# EasyEDA Pro project msq_ethrottle_tssop.eprj

# Schematic Schematic1

## Sheets
1 MCU: Create Date: 2023-01-29; Page Name: MCU; Project Name: msq-dbw; Schematic Name: Schematic1; Update Date: 2023-03-14; Company: EasyEDA.com; Drawed: EasyEDA Pro; Page Size: A4; Part Number: JLCPCB-002; Reviewed: EasyEDA Pro; Version: V0.1
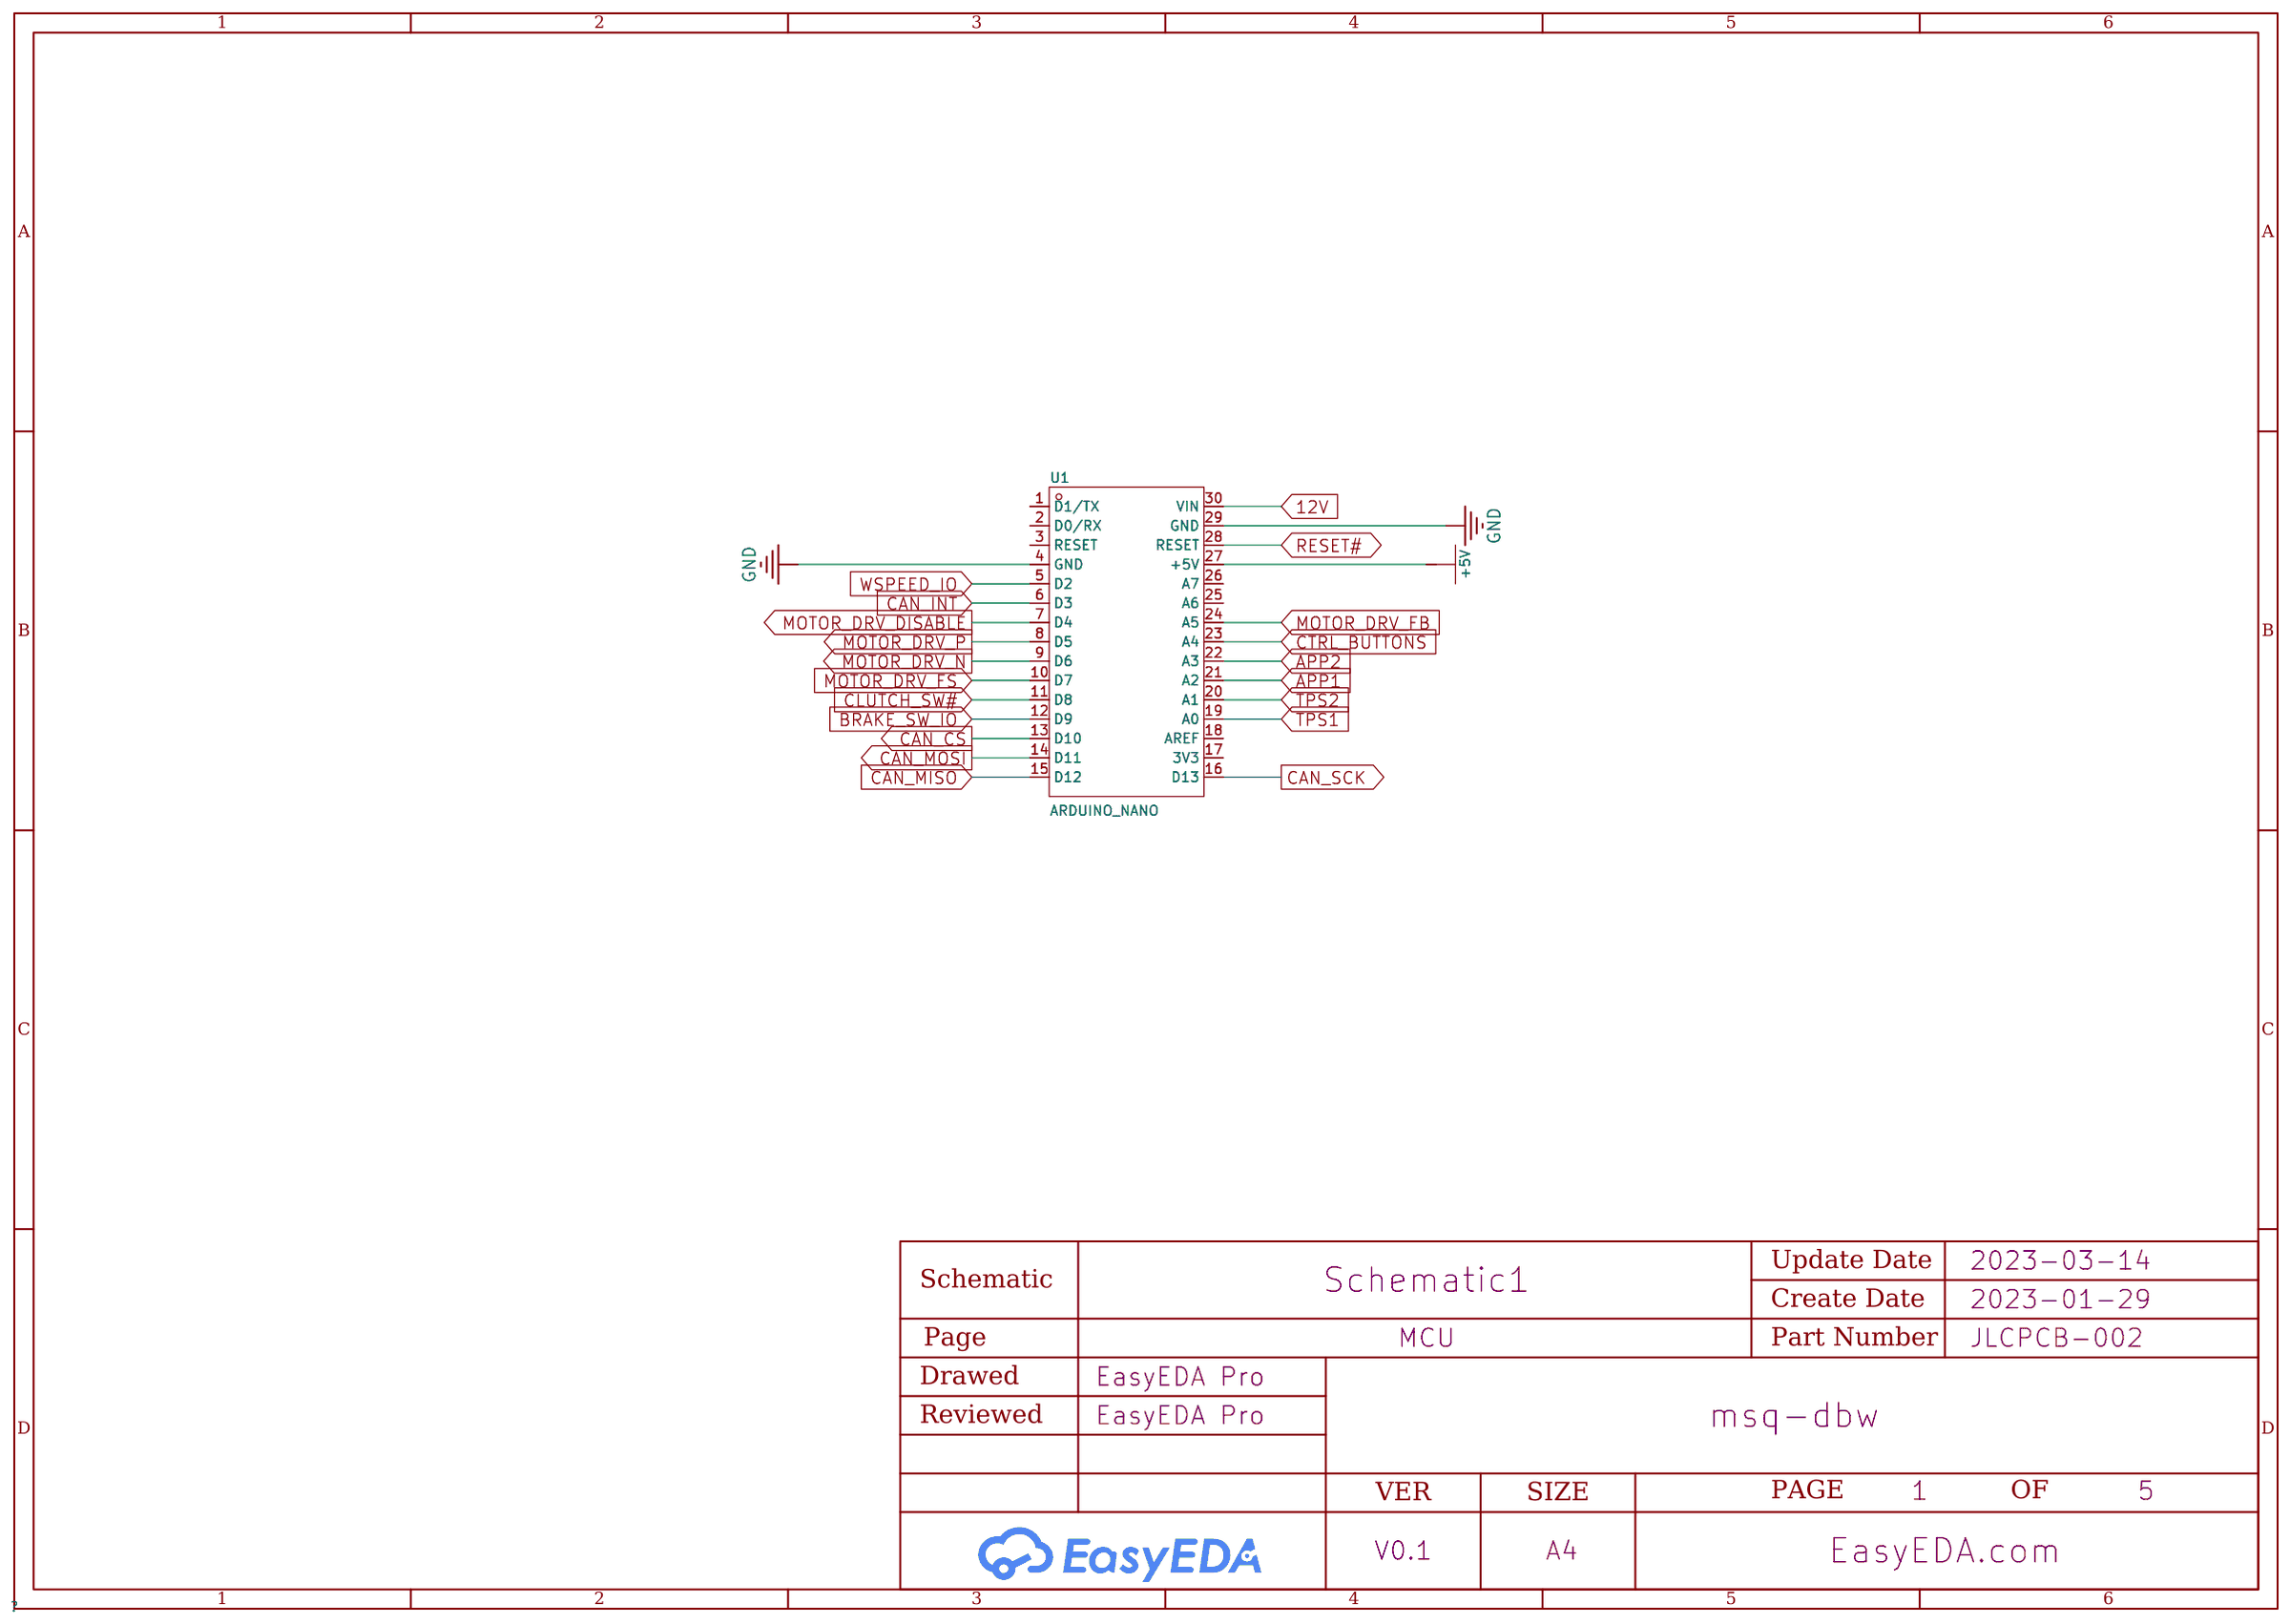
[diagram p0: MCU]
2 I/O: Page Name: I/O; Update Date: 2023-03-11
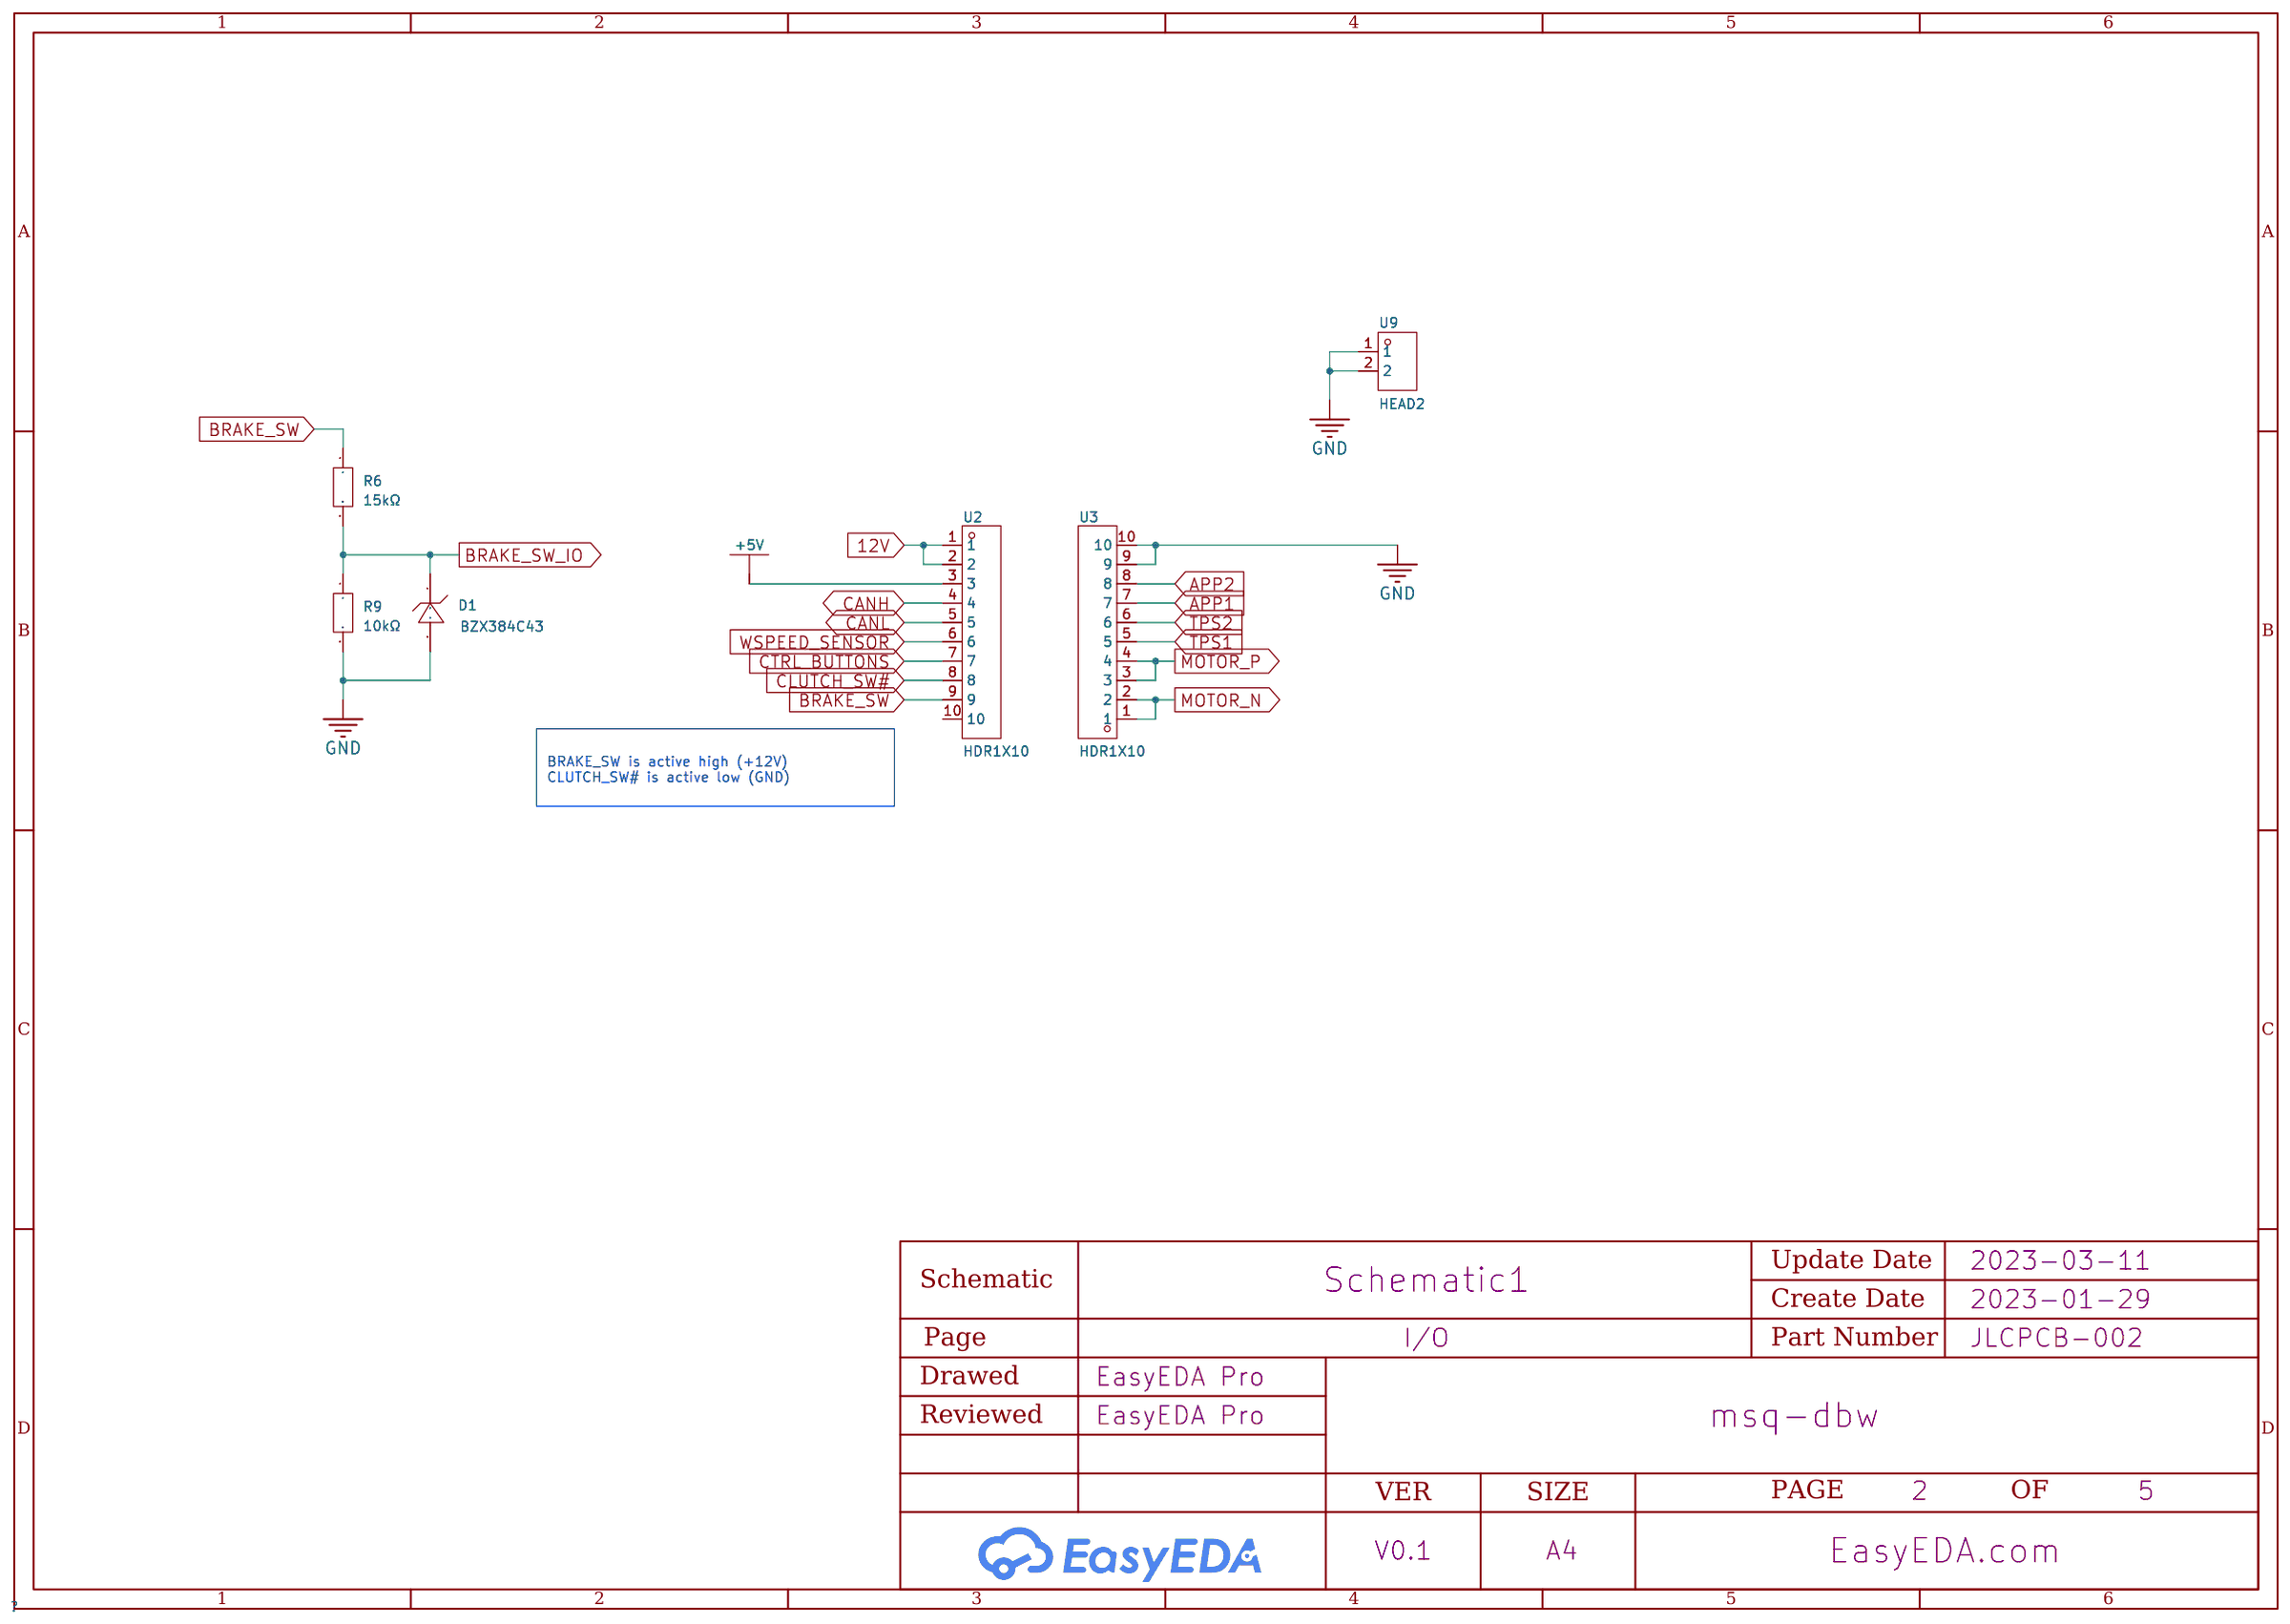
[diagram p1: I/O]
3 CAN: Page Name: CAN
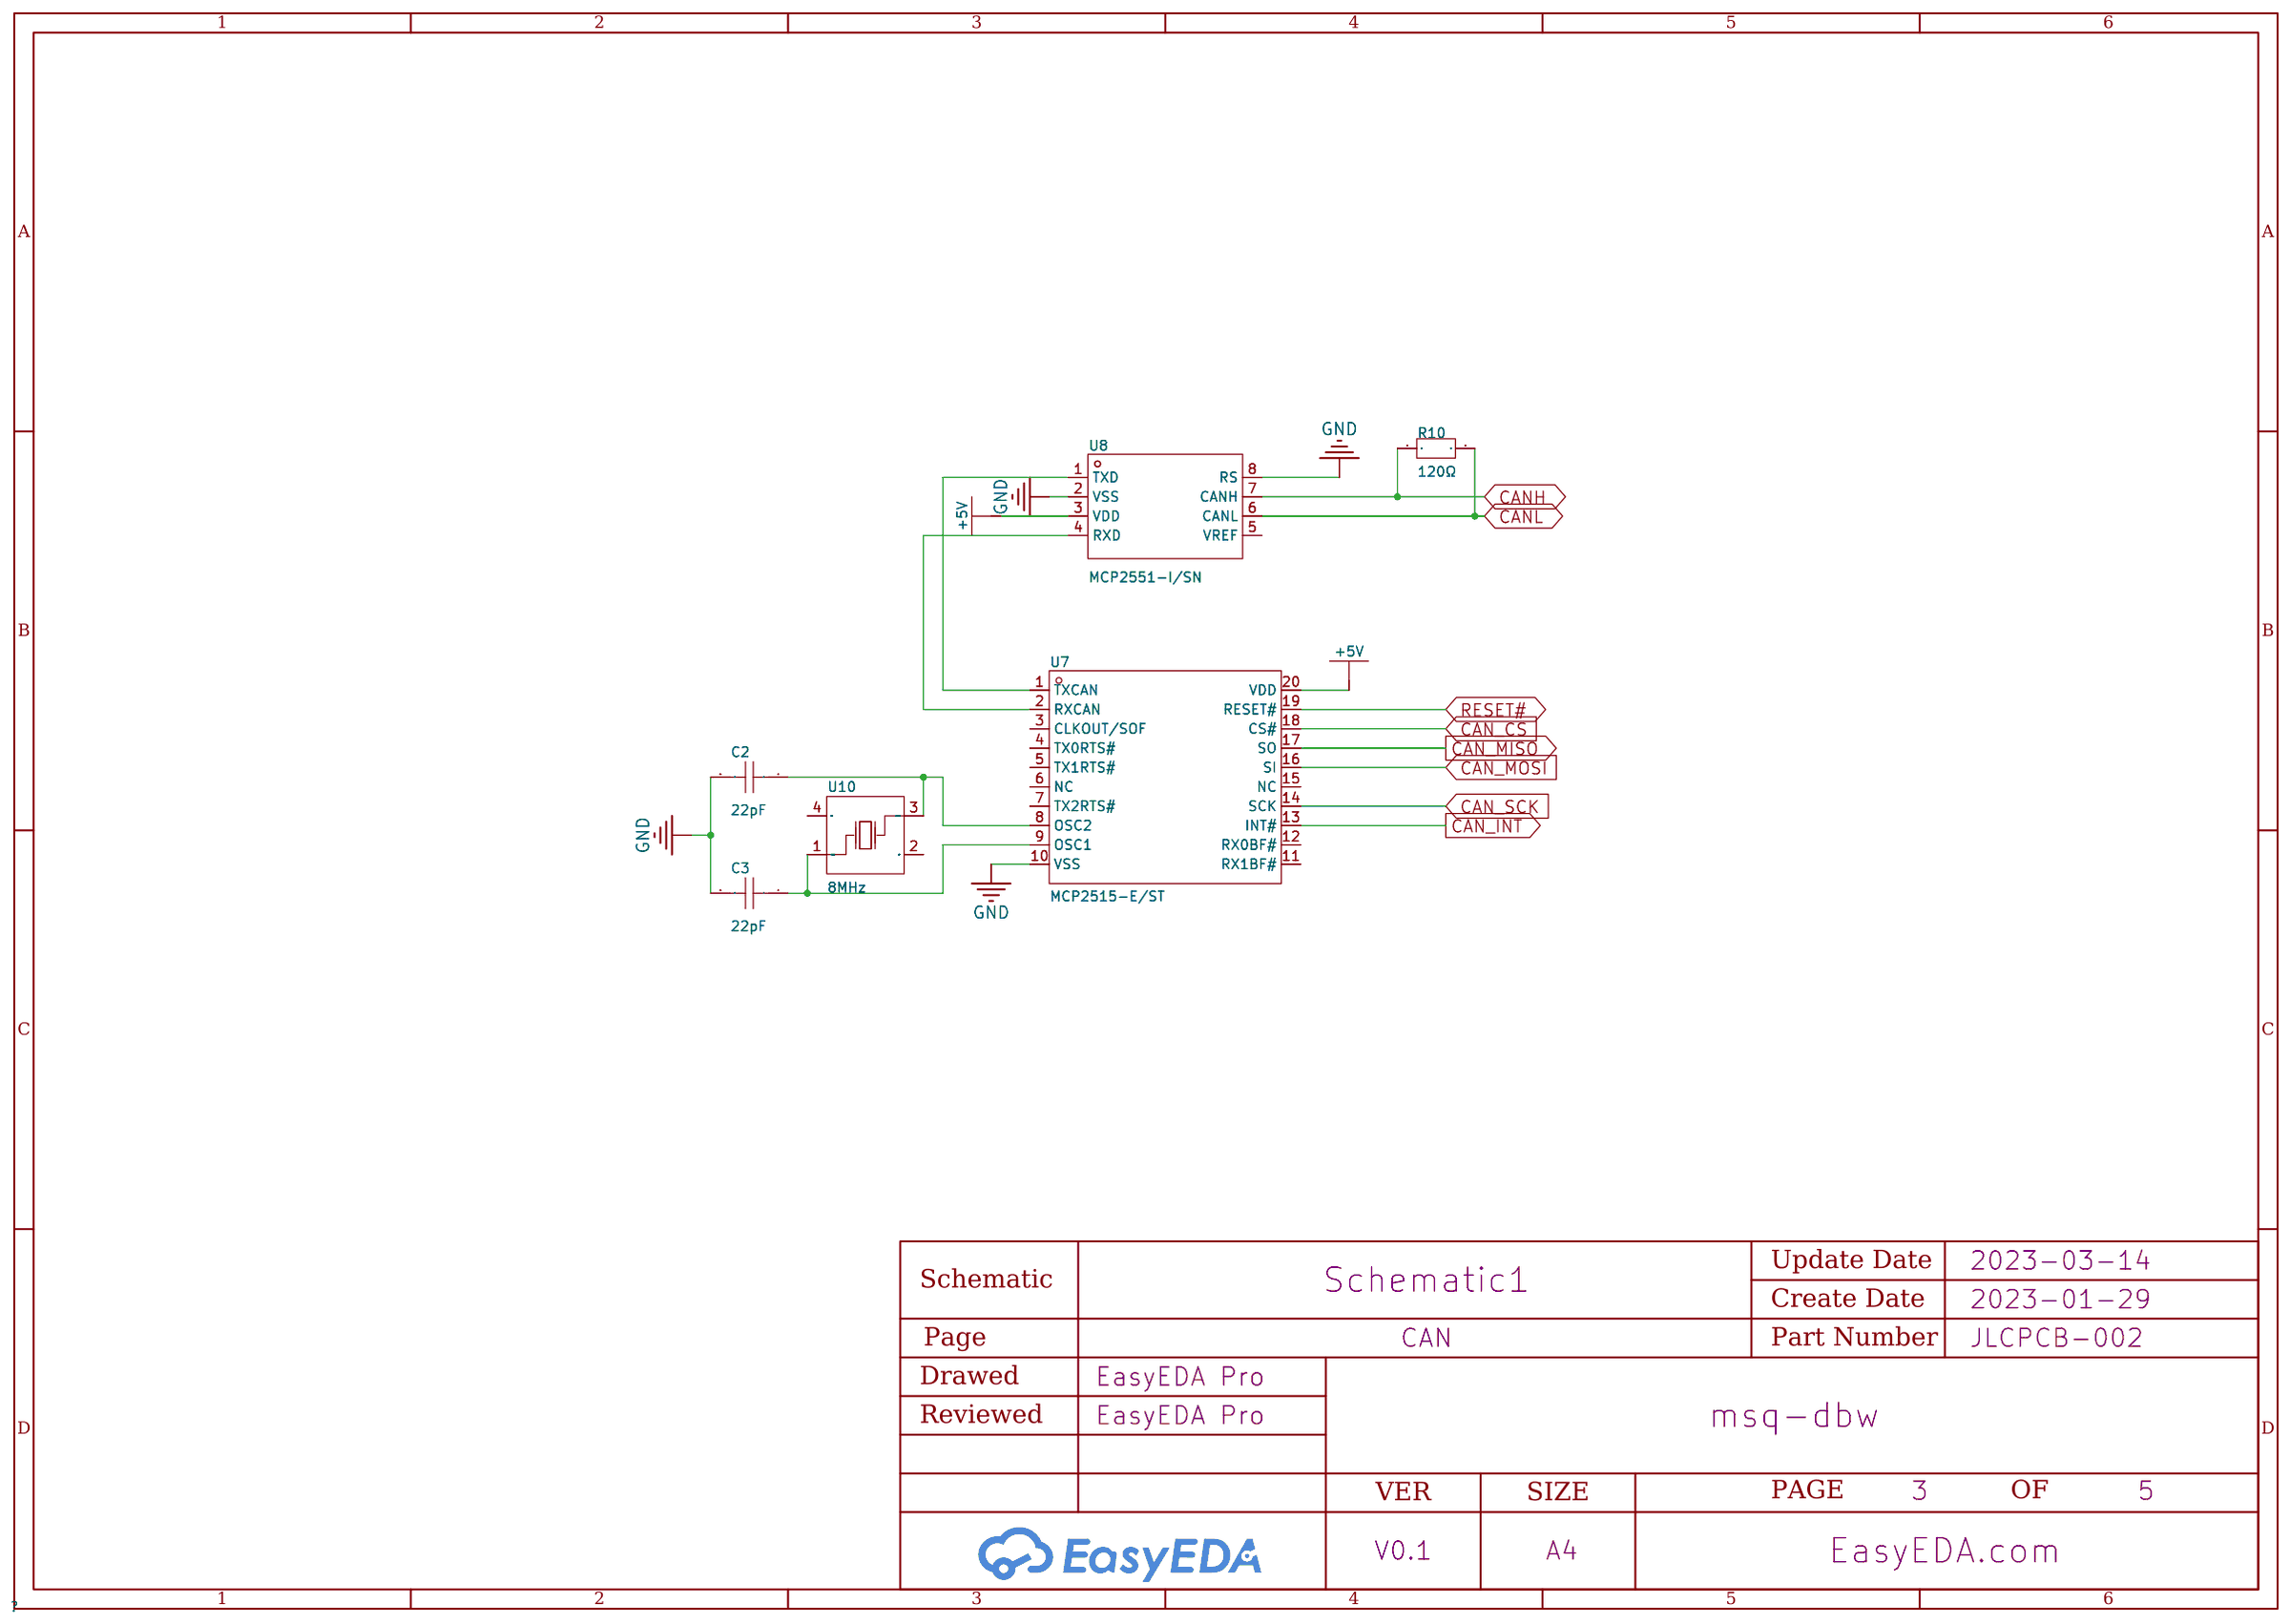
[diagram p2: CAN]
4 WheelSpeed: Page Name: WheelSpeed; Project Name: msq_ethrottle_tssop
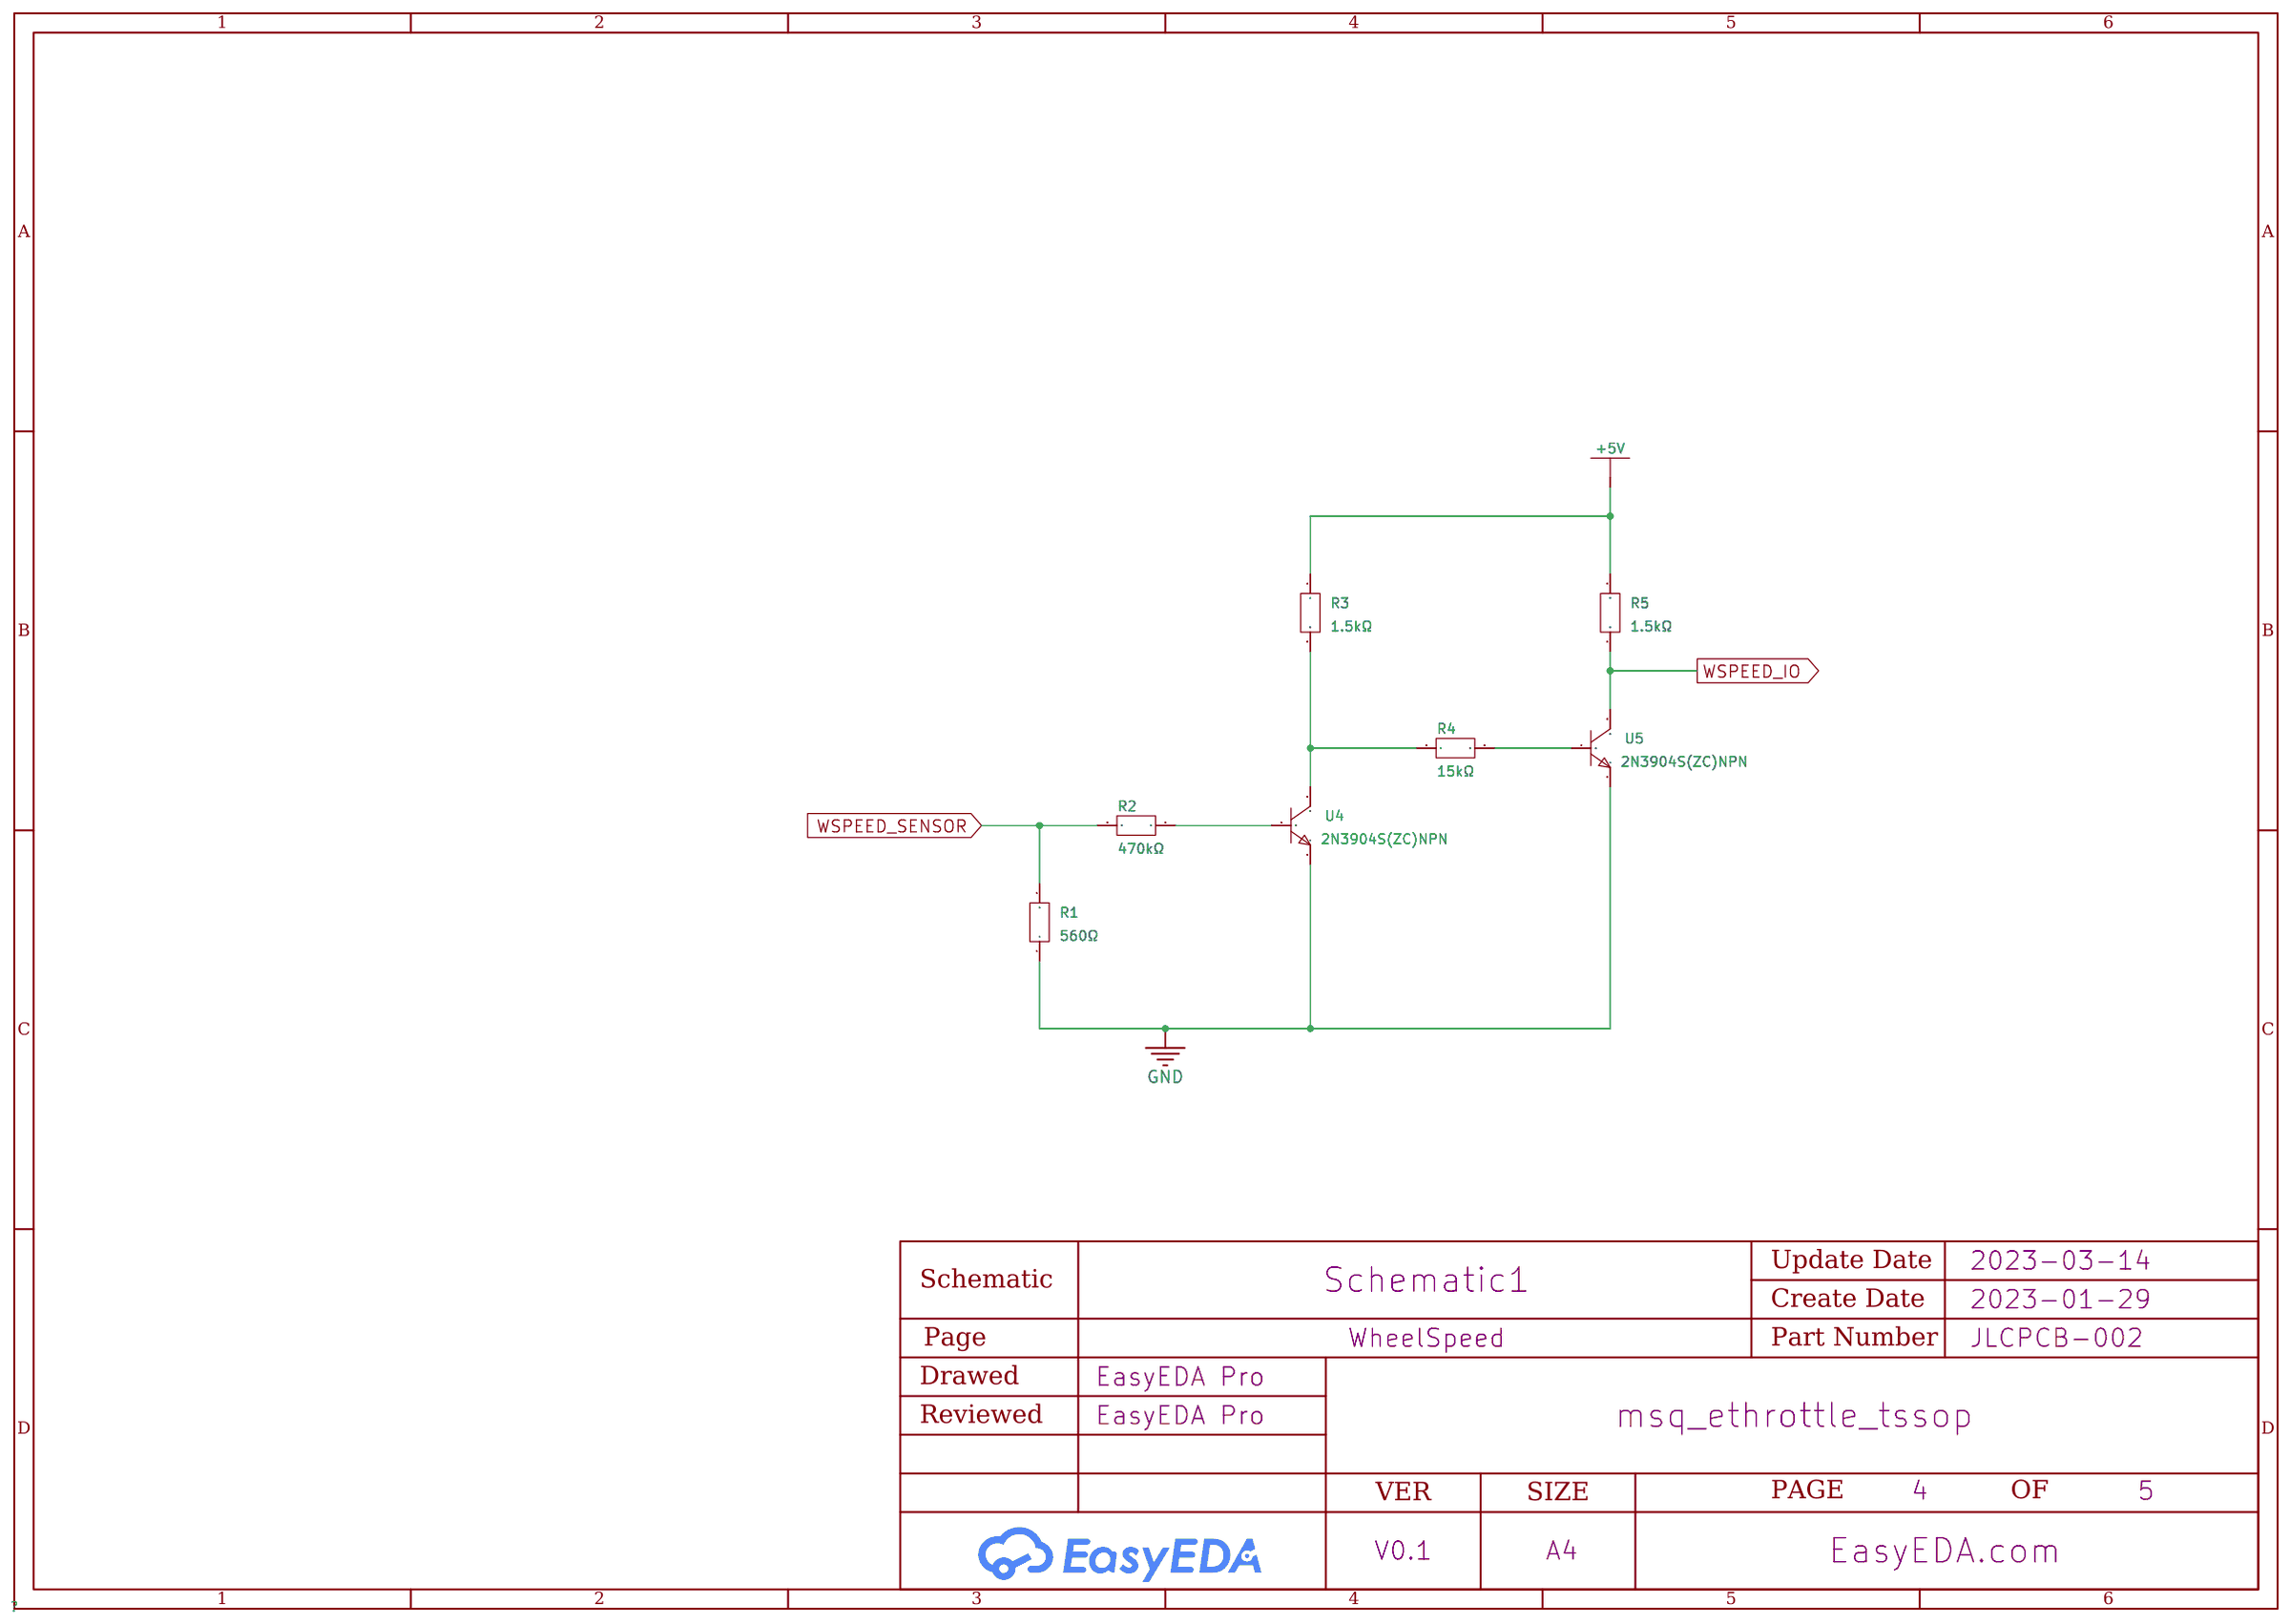
[diagram p3: WheelSpeed]
5 MotorDriver: Page Name: MotorDriver; Update Date: 2023-03-11
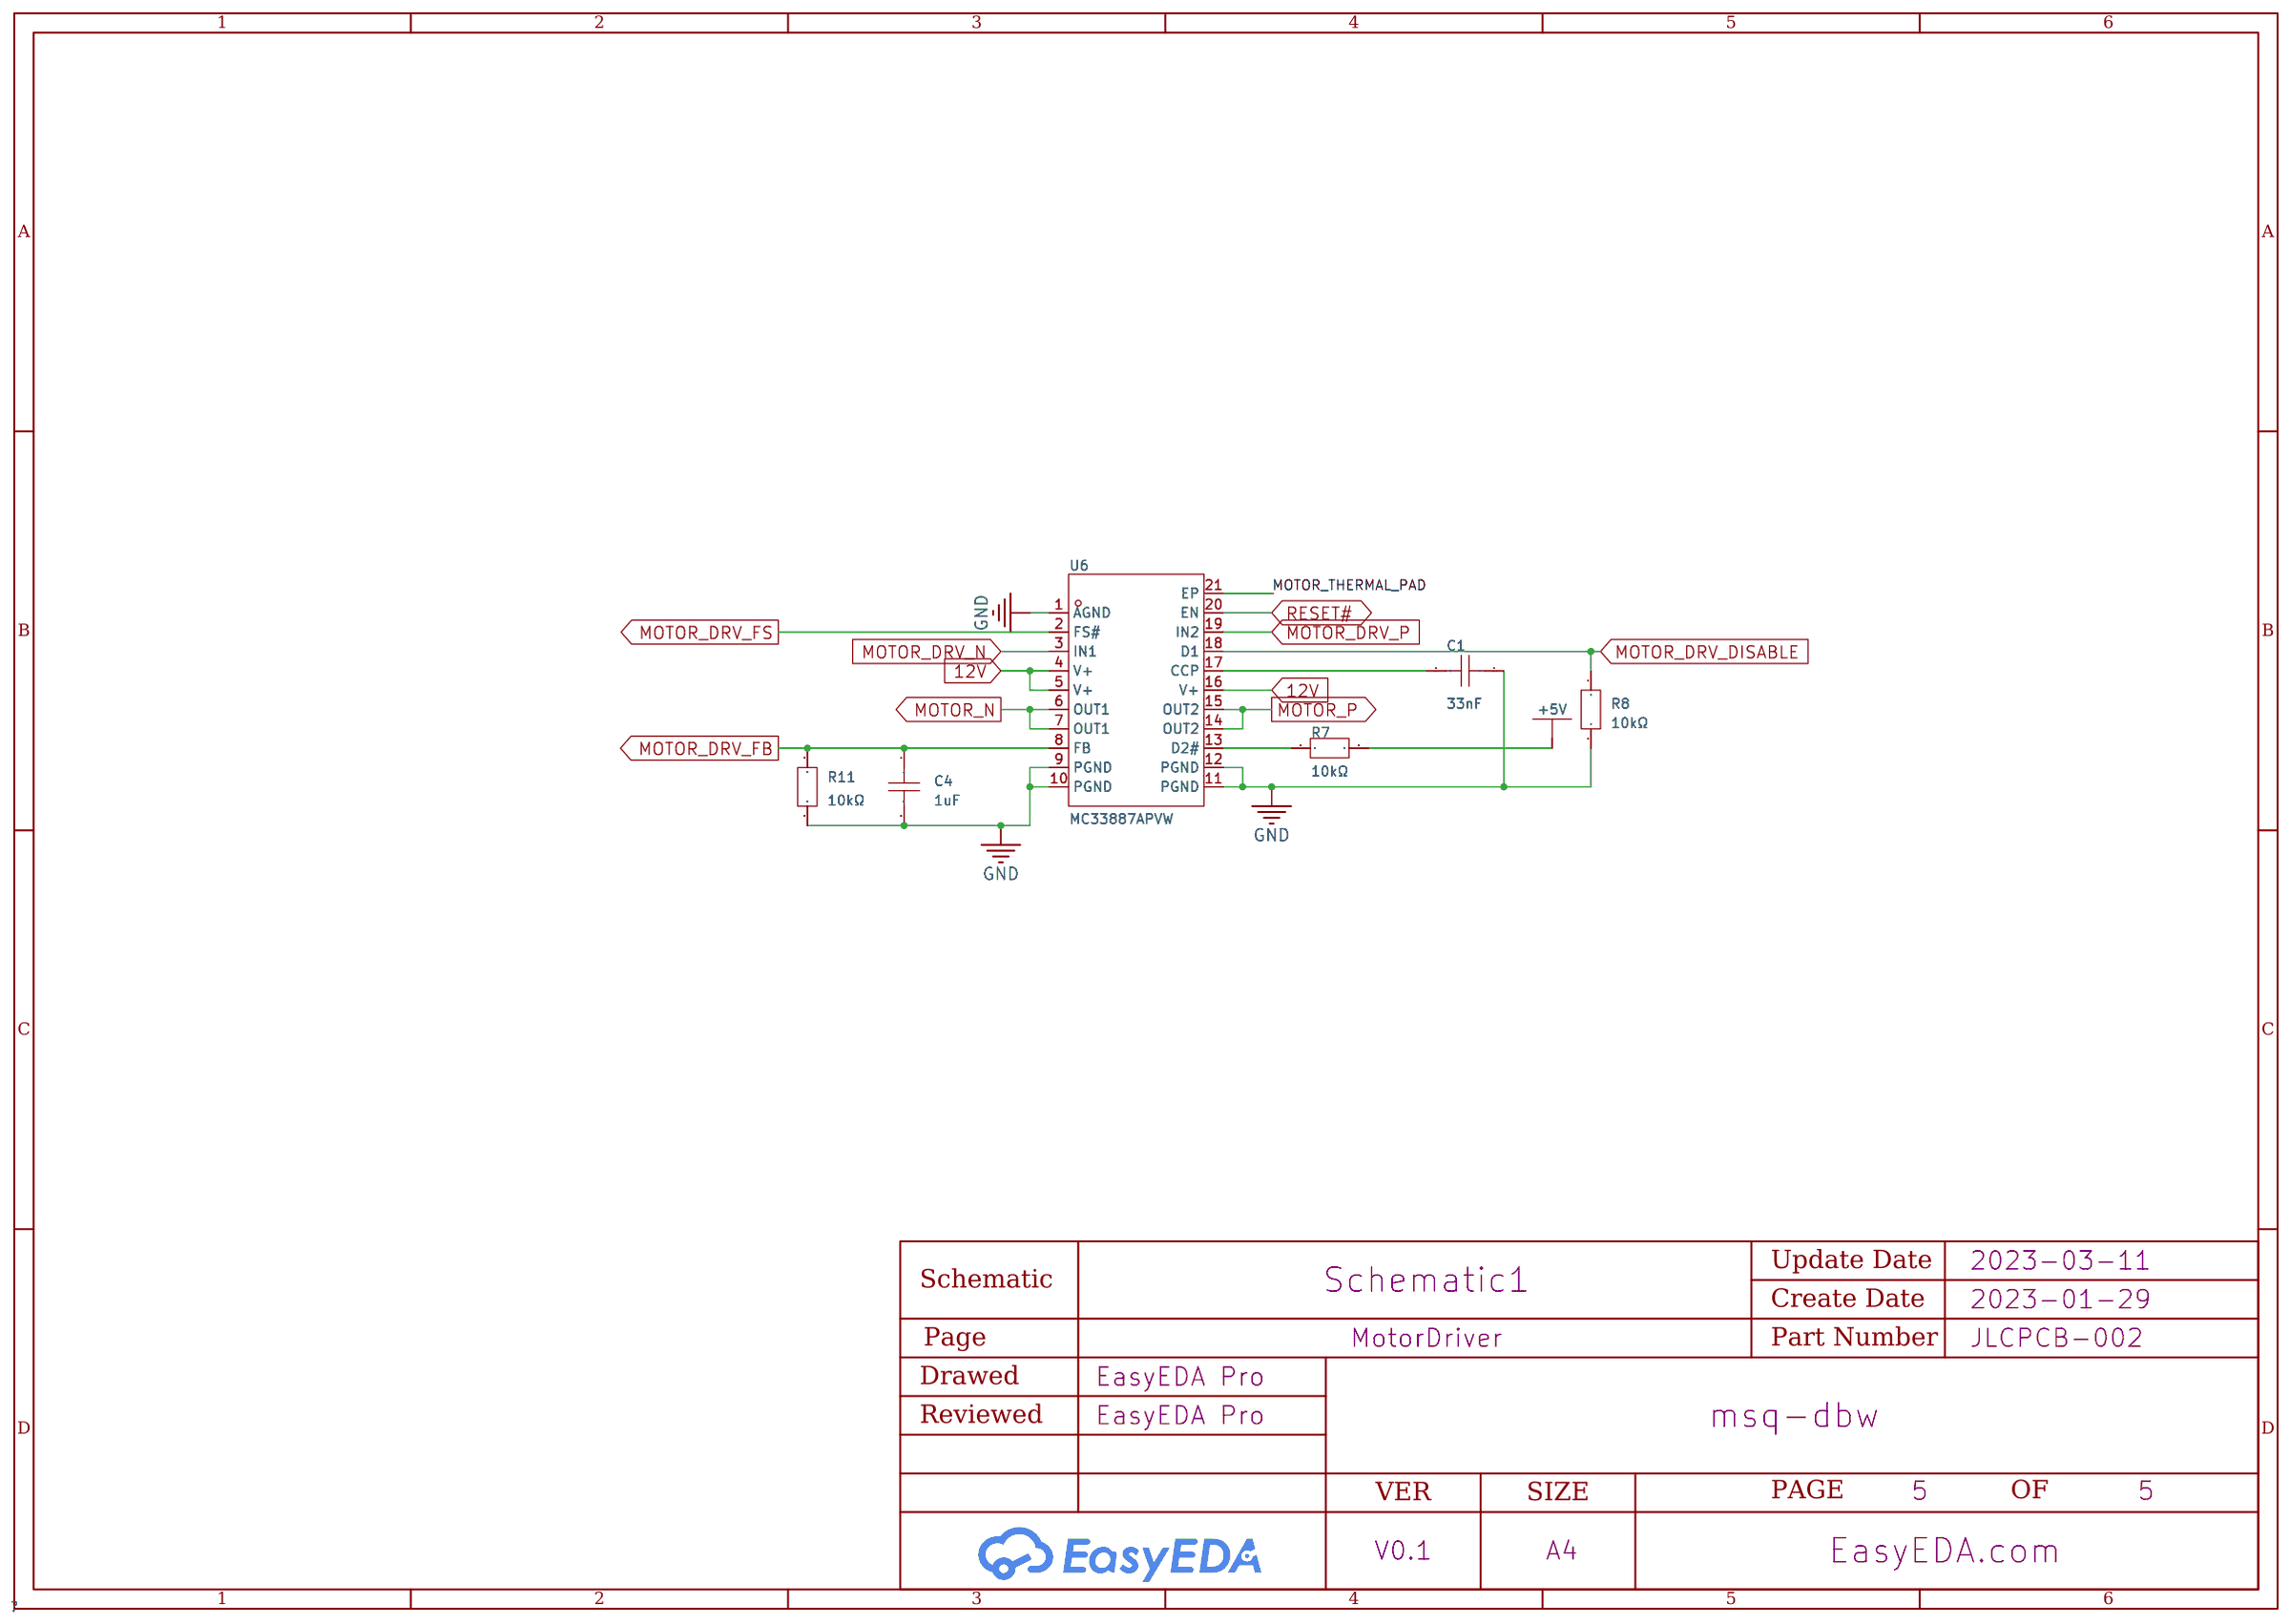
[diagram p4: MotorDriver]

## Parts
sheet CAN
C2  22pF  [C0603]
C3  22pF  [C0603]
R10  120Ω  [R0603]
U7  MCP2515-E/ST  [TSSOP-20_L6.5-W4.4-P0.65-LS6.4-BL]
U8  MCP2551-I/SN  [SOIC-8_L4.9-W3.9-P1.27-LS6.0-BL]
U10  8MHz  [CRYSTAL-SMD_4P-L3.2-W2.5-BL]
sheet I/O
D1  BZX384C43  [SOD-323_L1.7-W1.3-LS2.6-RD]
R6  15kΩ  [R0603]
R9  10kΩ  [R0603]
U2  HDR1X10  [HDR-TH_10P-P2.54-V-F_C9900008052]
U3  HDR1X10  [HDR-TH_10P-P2.54-V-F_C9900008052]
U9  HEAD2  [HDR-TH_2P-P2.54-V-M]
sheet MCU
U1  ARDUINO_NANO  [COMM-TH_ARDUINO_NANO]
sheet MotorDriver
C1  33nF  [C0603]
C4  1uF  [C0603]
R7  10kΩ  [R0603]
R8  10kΩ  [R0603]
R11  10kΩ  [R0603]
U6  MC33887APVW  [HSOP-20_L15.9-W11.0-P1.27-LS14.2-TL-EP]
sheet WheelSpeed
R1  560Ω  [R0603]
R2  470kΩ  [R0603]
R3  1.5kΩ  [R0603]
R4  15kΩ  [R0603]
R5  1.5kΩ  [R0603]
U4  2N3904S(ZC)NPN  [SOT-23-3_L2.9-W1.3-P0.95-LS2.4-BR]
U5  2N3904S(ZC)NPN  [SOT-23-3_L2.9-W1.3-P0.95-LS2.4-BR]

## Library data of the parts
C1-C4 = CAP_0603: Supplier Footprint: 0603
R1-R11 = 0603WAF1002T5E: Type:Thick Film Resistors Resistance: Tolerance:±1% Tolerance:±1% Power(Watts): Temperature Coefficient:±100ppm/℃ Temperature Coefficient:±100ppm/℃ Overload Voltage (Max): Operating Temperature Range:-55℃~+155℃ Operating Temperature Range:-55℃~+155℃; LCSC Part Name: 10kΩ ±1% 100mW; Supplier Part: C25804; Manufacturer: UNI-ROYAL(厚声); Supplier Footprint: 0603; JLCPCB Part Class: Basic Part; Datasheet: https://atta.szlcsc.com/upload/public/pdf/source/20200306/C422600_1E6D84923E4A46A82E41ADD87F860B5C.pdf; Supplier: LCSC; Type: Thick Film Resistors; Tolerance: ±1%; Temperature Coefficient: ±100ppm/℃; Operating Temperature Range: -55℃~+155℃
U7 = MCP2515-E/ST: Type:; Supplier Part: C638680; Manufacturer: MICROCHIP(美国微芯); Supplier Footprint: TSSOP-20; JLCPCB Part Class: Extended Part; Datasheet: https://atta.szlcsc.com/upload/public/pdf/source/20200807/C638680_188C1A92B4F0DA818DFF39F64278BDB0.pdf; Supplier: LCSC
U8 = MCP2551-I/SN: Type:Transceiver Supply Voltage:4.5V~5.5V Supply Voltage:4.5V~5.5V; Supplier Part: C7376; Manufacturer: MICROCHIP(美国微芯); Supplier Footprint: SOIC-8-150mil; JLCPCB Part Class: Extended Part; Datasheet: https://atta.szlcsc.com/upload/public/pdf/source/20140724/1457707166784.pdf; Supplier: LCSC; Type: Transceiver; Supply Voltage: 4.5V~5.5V
U10 = L327S270S11L: Frequency:27MHz Frequency Tolerance:±10ppm Frequency Tolerance:±10ppm Load Capacitance: Operating Temperature: Operating Temperature:; LCSC Part Name: 27MHz ±10ppm 18pF; Supplier Part: C5261230; Manufacturer: Lucki(蓝晶); Supplier Footprint: SMD3225-4P; Datasheet: https://atta.szlcsc.com/upload/public/pdf/source/20221202/60F06CA666B721E79745927FA5DE9DEE.pdf; Supplier: LCSC; Frequency Tolerance: ±10ppm
D1 = BZX384C43: Zener Voltage (Nom):- Zener Voltage (Range):40V~46V Zener Voltage (Range):40V~46V Tolerance:±2% Tolerance:±2% Power Dissipation:200mW Reverse Leakage Current (Ir):50nA@700mV; LCSC Part Name: ±2% 200mW; Supplier Part: C409610; Manufacturer: EIC; Supplier Footprint: SOD-323; JLCPCB Part Class: Extended Part; Datasheet: https://atta.szlcsc.com/upload/public/pdf/source/20190801/C409610_9504911DF9FC98872F7A65F99ECB6C6D.pdf; Supplier: LCSC; Zener Voltage (Range): 40V~46V; Tolerance: ±2%; Power Dissipation: 200mW; Reverse Leakage Current (Ir): 50nA@700mV
U2 U3 = HDR1X10: Supplier Part: C9900008052; Supplier Footprint: 1X10P2.54mm塑高3.5mm; Datasheet: https://atta.szlcsc.comnull; Supplier: LCSC
U9 = HEAD2: Supplier Part: C9900010030; Supplier Footprint: HDR-TH_2P-P2.54; Datasheet: https://atta.szlcsc.comnull; Supplier: LCSC
U1 = ARDUINO_NANO: Supplier Part: C9900017879; Supplier Footprint: 插件; Datasheet: https://atta.szlcsc.comnull; Supplier: LCSC
U6 = MC33887APVW: Type:有刷直流电机 Supply Voltage:5V~28V Supply Voltage:5V~28V Output Current:5A Interface:Parallel Operating Temperature:-40℃~+150℃@(Tj) Operating Temperature:-40℃~+150℃@(Tj); Supplier Part: C1556894; Manufacturer: NXP(恩智浦); Supplier Footprint: HSOP-20-EP-11.0mm; JLCPCB Part Class: Extended Part; Datasheet: https://atta.szlcsc.com/upload/public/pdf/source/20210714/C729071_98FB39D99A873BDAEDBADF85E33ACDF2.pdf; Supplier: LCSC; Type: 有刷直流电机; Supply Voltage: 5V~28V; Output Current: 5A; Interface: Parallel; Operating Temperature: -40℃~+150℃@(Tj)
U4 U5 = 2N3904S(ZC)NPN: Supplier Part: C9900013034; Supplier Footprint: SOT-23; Datasheet: https://atta.szlcsc.comnull; Supplier: LCSC

## Nets
12V: U1.30(VIN) U2.1 U2.2 U6.4(V+) U6.5(V+) U6.16(V+)
+5V: R3.1 R5.2 R7.1 U1.27(+5V) U2.3 U7.20(VDD) U8.3(VDD)
GND: C1.1 C2.2 C3.2 C4.2 D1.2(A) R1.1 R8.2 R9.2 R11.1 U1.4(GND) U1.29(GND) U3.9 U3.10 U4.2(E) U5.2(E) U6.1(AGND) U6.9(PGND) U6.10(PGND) U6.11(PGND) U6.12(PGND) U7.10(VSS) U8.2(VSS) U8.8(RS) U9.1 U9.2
APP1: U1.21(A2) U3.7
APP2: U1.22(A3) U3.8
BRAKE_SW: R6.1 U2.9
BRAKE_SW_IO: D1.1(C) R6.2 R9.1 U1.12(D9)
CAN_CS: U1.13(D10) U7.18(CS#)
CAN_INT: U1.6(D3) U7.13(INT#)
CAN_MISO: U1.15(D12) U7.17(SO)
CAN_MOSI: U1.14(D11) U7.16(SI)
CAN_SCK: U1.16(D13) U7.14(SCK)
CANH: R10.1 U2.4 U8.7(CANH)
CANL: R10.2 U2.5 U8.6(CANL)
CLUTCH_SW#: U1.11(D8) U2.8
CTRL_BUTTONS: U1.23(A4) U2.7
MOTOR_DRV_DISABLE: R8.1 U1.7(D4) U6.18(D1)
MOTOR_DRV_FB: C4.1 R11.2 U1.24(A5) U6.8(FB)
MOTOR_DRV_FS: U1.10(D7) U6.2(FS#)
MOTOR_DRV_N: U1.9(D6) U6.3(IN1)
MOTOR_DRV_P: U1.8(D5) U6.19(IN2)
MOTOR_N: U3.1 U3.2 U6.6(OUT1) U6.7(OUT1)
MOTOR_P: U3.3 U3.4 U6.14(OUT2) U6.15(OUT2)
MOTOR_THERMAL_PAD: U6.21(EP)
RESET#: U1.28(RESET) U6.20(EN) U7.19(RESET#)
TPS1: U1.19(A0) U3.5
TPS2: U1.20(A1) U3.6
WSPEED_IO: R5.1 U1.5(D2) U5.3(C)
WSPEED_SENSOR: R1.2 R2.2 U2.6
$3N506: U7.1(TXCAN) U8.1(TXD)
$3N511: U7.2(RXCAN) U8.4(RXD)
$3N1213: C2.1 U7.8(OSC2) U10.3(Xtal Terminal (Output))
$3N1221: C3.1 U7.9(OSC1) U10.1(Xtal Terminal (Input))
$4N837: R2.1 U4.1(B)
$4N858: R3.2 R4.1 U4.3(C)
$4N875: R4.2 U5.1(B)
$5N1075: R7.2 U6.13(D2#)
$5N1397: C1.2 U6.17(CCP)

Not connected (* = marked no-connect by the designer): U1 1(D1/TX) 2(D0/RX) 3(RESET) 17(3V3) 18(AREF) 25(A6) 26(A7); U2 10; U7 3(CLKOUT/SOF) 4(TX0RTS#) 5(TX1RTS#) 6(NC) 7(TX2RTS#) 11(RX1BF#) 12(RX0BF#) 15(NC); U8 5(VREF); U10 2(GND) 4(GND)

## Notes on the sheets
sheet 2
- BRAKE_SW is active high (+12V)
  CLUTCH_SW# is active low (GND)

# Board PCB1
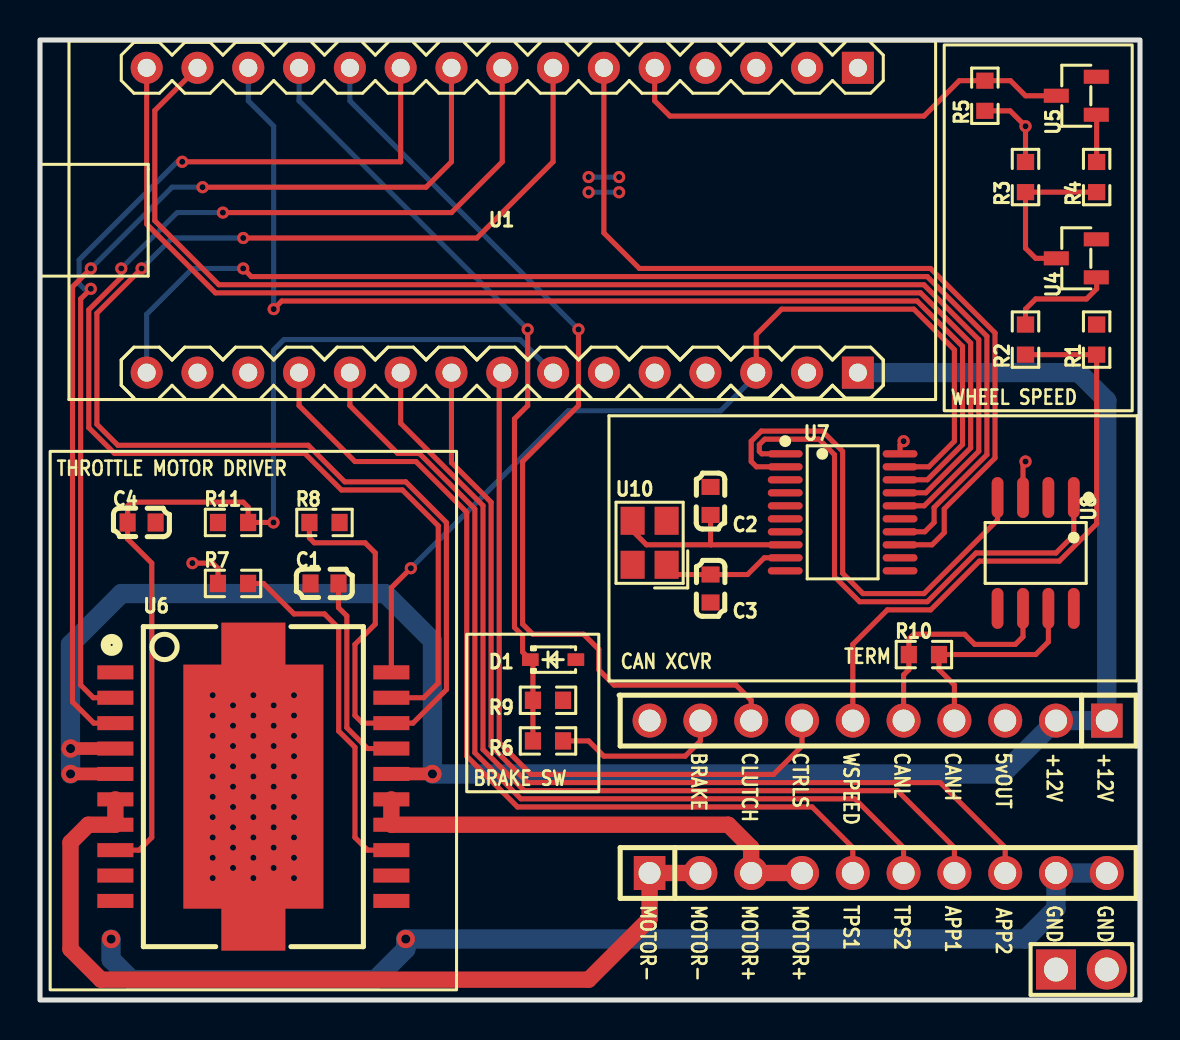
[diagram p5: board, top side]
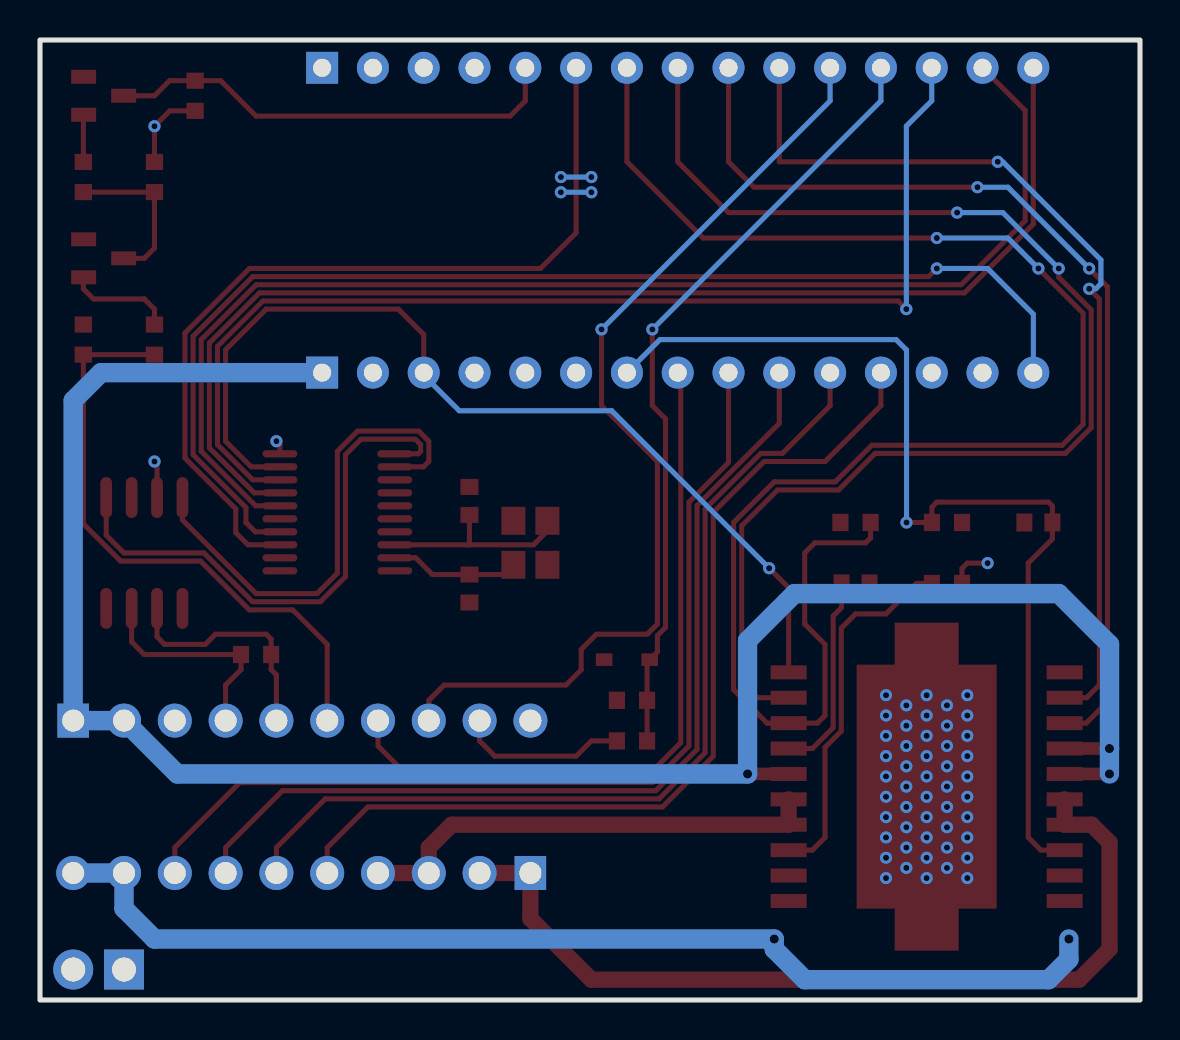
[diagram p6: board, bottom side, seen from below]

Outline 55 x 48 mm; copper layers: Top Layer, Bottom Layer. Coordinates in mm from the lower left corner of the outline.
Outline path: rectangle 0,48 55,0
Stack: Top Layer 0.035mm / Dielectric1 1.51mm FR4 er 4.5 / Bottom Layer 0.035mm

## Design rules (mm)
spacing safeClearance (default): track to track 0.152, other pairs 0.152 to 0.3
track width trackWidth (default): min 0.127, default 0.254, max 2.54
track width trackWidthMotor: min 0.813, default 1.016, max 2.54
differential pair differentialPair (default): width min 0.127, default 0.254, max 2.54; gap min 0.152, default 0.152
via viaSize (default): diameter min 0.5, default 0.61, max 10; hole min 0.3, default 0.305, max 6
net MOTOR_N uses trackWidthMotor
net MOTOR_P uses trackWidthMotor

## Placement (name value [footprint] x y rotation side)
C1  33nF  [C0603]  14.22 20.83 0 top
C2  22pF  [C0603]  33.53 24.95 90 top
C3  22pF  [C0603]  33.53 20.57 270 top
C4  1uF  [C0603]  5.08 23.88 0 top
D1  BZX384C43  [SOD-323_L1.7-W1.3-LS2.6-RD]  25.65 17.02 0 top
R1  560Ω  [R0603]  52.83 33.02 270 top
R2  470kΩ  [R0603]  49.28 33.02 270 top
R3  1.5kΩ  [R0603]  49.28 41.15 270 top
R4  15kΩ  [R0603]  52.83 41.15 90 top
R5  1.5kΩ  [R0603]  47.24 45.21 270 top
R6  15kΩ  [R0603]  25.4 12.95 180 top
R7  10kΩ  [R0603]  9.65 20.83 0 top
R8  10kΩ  [R0603]  14.22 23.88 0 top
R9  10kΩ  [R0603]  25.4 14.99 0 top
R10  120Ω  [R0603]  44.2 17.27 180 top
R11  10kΩ  [R0603]  9.65 23.88 0 top
U1  ARDUINO_NANO  [COMM-TH_ARDUINO_NANO]  23.11 38.99 0 top
U2  HDR1X10  [HDR-TH_10P-P2.54-V-F_C9900008052]  41.91 13.97 180 top
U3  HDR1X10  [HDR-TH_10P-P2.54-V-F_C9900008052]  41.91 6.35 0 top
U4  2N3904S(ZC)NPN  [SOT-23-3_L2.9-W1.3-P0.95-LS2.4-BR]  51.82 37.08 0 top
U5  2N3904S(ZC)NPN  [SOT-23-3_L2.9-W1.3-P0.95-LS2.4-BR]  51.82 45.21 0 top
U6  MC33887APVW  [HSOP-20_L15.9-W11.0-P1.27-LS14.2-TL-EP]  10.67 10.67 0 top
U7  MCP2515-E/ST  [TSSOP-20_L6.5-W4.4-P0.65-LS6.4-BL]  40.13 24.38 270 top
U8  MCP2551-I/SN  [SOIC-8_L4.9-W3.9-P1.27-LS6.0-BL]  49.78 22.35 180 top
U9  HEAD2  [HDR-TH_2P-P2.54-V-M]  52.07 1.52 0 top
U10  8MHz  [CRYSTAL-SMD_4P-L3.2-W2.5-BL]  30.48 22.86 90 top

## Footprints (pads in the part's own frame, mm; a bottom-side part is the same pattern mirrored in y, then rotated)
C0603
  rect 0.8x0.9 smd: 1(-0.7,0) 2(0.7,0)
COMM-TH_ARDUINO_NANO
  rect 1.6x1.6 hole 0.9: 1(17.78,7.62) 30(17.78,-7.62)
  round 1.6 hole 0.9: 2(15.24,7.62) 3(12.7,7.62) 4(10.16,7.62) 5(7.62,7.62) 6(5.08,7.62) 7(2.54,7.62) 8(0,7.62) 9(-2.54,7.62) 10(-5.08,7.62) 11(-7.62,7.62) 12(-10.16,7.62) 13(-12.7,7.62) 14(-15.24,7.62) 15(-17.78,7.62) 16(-17.78,-7.62) 17(-15.24,-7.62) 18(-12.7,-7.62) 19(-10.16,-7.62) 20(-7.62,-7.62) 21(-5.08,-7.62) 22(-2.54,-7.62) 23(0,-7.62) 24(2.54,-7.62) 25(5.08,-7.62) 26(7.62,-7.62) 27(10.16,-7.62) 28(12.7,-7.62) 29(15.24,-7.62)
CRYSTAL-SMD_4P-L3.2-W2.5-BL
  rect 1.4x1.2 smd: 1(-1.1,-0.85) 2(1.1,-0.85) 3(1.1,0.85) 4(-1.1,0.85)
HDR-TH_2P-P2.54-V-M
  rect 2x2 hole 1.2: 1(-1.27,0)
  round 2 hole 1.2: 2(1.27,0)
HDR-TH_10P-P2.54-V-F_C9900008052
  rect 1.575x1.7 hole 1.1: 1(-11.43,0)
  round 1.7 hole 1.1: 2(-8.89,0) 3(-6.35,0) 4(-3.81,0) 5(-1.27,0) 6(1.27,0) 7(3.81,0) 8(6.35,0) 9(8.89,0) 10(11.43,0)
HSOP-20_L15.9-W11.0-P1.27-LS14.2-TL-EP
  rect 1.8x0.7 smd: 1(-6.9,5.713) 2(-6.9,4.445) 3(-6.9,3.175) 4(-6.9,1.905) 5(-6.9,0.635) 6(-6.9,-0.635) 7(-6.9,-1.905) 8(-6.9,-3.175) 9(-6.9,-4.447) 10(-6.9,-5.715) 11(6.9,-5.715) 12(6.9,-4.445) 13(6.9,-3.175) 14(6.9,-1.905) 15(6.9,-0.635) 16(6.9,0.635) 17(6.9,1.905) 18(6.9,3.175) 19(6.9,4.445) 20(6.9,5.715)
  custom 7x16.4 smd: 21(0,0)
R0603
  rect 0.806x0.864 smd: 1(-0.753,0) 2(0.753,0)
SOD-323_L1.7-W1.3-LS2.6-RD
  rect 0.83x0.63 smd: 1(-1.14,0) 2(1.14,0)
SOIC-8_L4.9-W3.9-P1.27-LS6.0-BL
  oval 0.588x2.045 smd: 1(-1.905,-2.772) 2(-0.635,-2.772) 3(0.635,-2.772) 4(1.905,-2.772) 5(1.905,2.772) 6(0.635,2.772) 7(-0.635,2.772) 8(-1.905,2.772)
SOT-23-3_L2.9-W1.3-P0.95-LS2.4-BR
  rect 1.25x0.7 smd: 1(1,-0.95) 2(1,0.95) 3(-1,0)
TSSOP-20_L6.5-W4.4-P0.65-LS6.4-BL
  oval 0.364x1.742 smd: 1(-2.925,-2.871) 2(-2.275,-2.871) 3(-1.625,-2.871) 4(-0.975,-2.871) 5(-0.325,-2.871) 6(0.325,-2.871) 7(0.975,-2.871) 8(1.625,-2.871) 9(2.275,-2.871) 10(2.925,-2.871) 11(2.925,2.871) 12(2.275,2.871) 13(1.625,2.871) 14(0.975,2.871) 15(0.325,2.871) 16(-0.325,2.871) 17(-0.975,2.871) 18(-1.625,2.871) 19(-2.275,2.871) 20(-2.925,2.871)

## Nets
As in the schematic.

Pads without a net: U1 1 2 3 17 18 25 26; U2 10; U7 3 4 5 6 7 11 12 15; U8 5; U10 2 4

## Via types
v1: diameter 0.914, hole 0.457, Top Layer to Bottom Layer, 5 vias
v2: diameter 0.61, hole 0.305, Top Layer to Bottom Layer, 70 vias

## Routing (per net, layer and track width the routed paths; a pad name or vN(x,y) marks a point on that pad's centre or on a via; arc(x,y) is an arc through that point)
12V: length 103.7
  Top Layer w0.635: 3.77,12.57 v1(1.53,12.57) ; v1(19.62,11.3) U6.16 ; U6.5 v1(1.53,11.3)
  Bottom Layer w0.965: v1(1.53,11.3) v1(1.53,12.57) 1.52,12.58 1.52,17.78 4.06,20.32 17.27,20.32 19.62,17.97 v1(19.62,11.3) 48.13,11.3 U2.2 U2.1 53.34,29.97 51.94,31.37 U1.30
+5V: length 8.8
  Top Layer w0.254: v2(7.62,21.84) 8.64,21.84 8.9,21.58 R7.1 ; v2(49.28,26.92) 49.15,26.8 U8.3 ; v2(43.18,27.94) 43,27.76 U7.20 ; R3.1 v2(49.28,43.69) 48.51,44.46 R5.2
GND: length 57.8
  Bottom Layer w0.254: v2(27.43,41.15) v2(28.96,41.15) ; v2(27.43,40.39) v2(28.96,40.39)
  Bottom Layer w0.965: v1(3.56,3.05) 3.56,2.03 4.57,1.02 16.76,1.02 18.29,2.54 v1(18.29,3.05) 49.28,3.05 50.8,4.57 U3.9 U3.10
APP1: length 47.4
  Top Layer w0.254: U3.7 45.72,7.62 42.88,10.47 24.21,10.47 22.15,12.53 22.15,24.72 18.03,28.84 U1.21
APP2: length 48.6
  Top Layer w0.254: U3.8 48.26,7.62 45.01,10.87 24.38,10.87 22.56,12.7 22.56,24.89 20.57,26.87 U1.22
BRAKE_SW: length 8.5
  Top Layer w0.254: U2.9 33.02,12.95 32.26,12.19 28.19,12.19 27.43,12.95 R6.1
BRAKE_SW_IO: length 39
  Top Layer w0.254: R6.2 R9.1 24.65,16.89 D1.1 24.13,17.4 24.13,18.22 23.72,18.63 23.72,29.06 24.38,29.72 v2(24.38,33.53)
  Bottom Layer w0.254: 12.95,46.61 12.95,44.96 v2(24.38,33.53)
CAN_CS: length 56.9
  Top Layer w0.254: v2(11.68,34.54) 12.09,34.95 43.86,34.95 46.13,32.68 46.13,27.77 44.36,26.01 U7.18
  Bottom Layer w0.254: 10.41,46.61 10.41,44.96 11.68,43.69 v2(11.68,34.54)
CAN_INT: length 43.4
  Top Layer w0.254: U7.13 44.6,22.76 45.21,23.37 45.21,24.56 47.75,27.1 47.75,33.35 44.53,36.58 29.97,36.58 28.19,38.35 28.19,46.61
CAN_MISO: length 61.2
  Top Layer w0.254: U7.17 44.29,25.36 46.53,27.6 46.53,32.85 44.02,35.36 8.77,35.36 5.33,38.8 5.33,46.61
CAN_MOSI: length 62.8
  Top Layer w0.254: 7.87,46.61 5.74,44.48 5.74,38.96 8.94,35.76 44.19,35.76 46.94,33.02 46.94,27.44 44.21,24.71 U7.16
CAN_SCK: length 59.6
  Top Layer w0.254: v2(10.16,36.58) 10.57,36.17 44.36,36.17 47.35,33.19 47.35,27.27 44.7,24.62 44.7,23.88 44.24,23.41 U7.14
  Bottom Layer w0.254: U1.16 5.33,34.29 7.62,36.58 v2(10.16,36.58)
CANH: length 11
  Top Layer w0.254: 50.42,19.58 50.42,17.91 49.78,17.27 R10.1 44.95,16.52 45.72,15.75 U2.4
CANL: length 11.8
  Top Layer w0.254: U8.6 49.15,18.16 48.77,17.78 46.74,17.78 46.23,18.29 43.69,18.29 43.44,18.04 R10.2 43.44,16.52 43.18,16.26 U2.5
CLUTCH_SW#: length 48.3
  Top Layer w0.254: v2(26.92,33.53) 26.92,29.72 24.13,26.92 24.13,18.8 24.64,18.29 27.18,18.29 27.94,17.53 27.94,16.51 28.7,15.75 34.8,15.75 35.56,14.99 U2.8
  Bottom Layer w0.254: v2(26.92,33.53) 15.49,44.96 15.49,46.61
CTRL_BUTTONS: length 36.2
  Top Layer w0.254: U1.23 22.96,31.22 22.96,12.87 24.55,11.28 36.68,11.28 38.1,12.7 U2.7
MOTOR_DRV_DISABLE: length 82.4
  Top Layer w0.254: 25.65,46.61 25.65,41.91 21.84,38.1 v2(10.16,38.1) ; v2(5.08,36.58) 2.84,34.34 2.84,28.78 3.89,27.74 13.41,27.74 15.24,25.91 18.29,25.91 20.32,23.88 20.32,15.52 18.65,13.84 U6.18 16.13,13.84 15.75,14.22 15.75,17.78 16.76,18.8 16.76,22.35 16.26,22.86 13.72,22.86 13.47,23.11 R8.1
  Bottom Layer w0.254: v2(5.08,36.58) 6.6,38.1 v2(10.16,38.1)
MOTOR_DRV_FB: length 50.9
  Top Layer w0.254: v2(11.67,23.88) R11.2 10.41,24.65 10.16,24.89 4.57,24.89 4.38,24.7 C4.1 4.38,23.05 5.59,21.84 5.59,8.13 4.95,7.49 3.77,7.49
  Bottom Layer w0.254: U1.24 24,33.02 12.19,33.02 11.67,32.5 v2(11.67,23.88)
MOTOR_DRV_FS: length 46.7
  Top Layer w0.254: U6.2 2.67,15.11 2.03,15.75 2.03,35.05 v2(2.54,35.56) ; v2(7.11,41.91) 18.03,41.91 18.03,46.61
  Bottom Layer w0.254: v2(7.11,41.91) 6.86,41.91 1.96,37.01 1.96,35.81 2.21,35.56 v2(2.54,35.56)
MOTOR_DRV_N: length 49.6
  Top Layer w0.254: 20.57,46.61 20.57,41.91 19.3,40.64 v2(8.13,40.64) ; U6.3 2.69,13.84 1.63,14.91 1.63,35.66 v2(2.54,36.58)
  Bottom Layer w0.254: v2(2.54,36.58) 6.6,40.64 v2(8.13,40.64)
MOTOR_DRV_P: length 64.6
  Top Layer w0.254: U6.19 19.18,15.11 19.91,15.85 19.91,23.71 18.12,25.5 15.07,25.5 13.24,27.33 3.72,27.33 2.44,28.62 2.44,34.51 4.06,36.13 v2(4.06,36.58) ; 23.11,46.61 23.11,41.91 20.57,39.37 v2(9.14,39.37)
  Bottom Layer w0.254: v2(4.06,36.58) 6.86,39.37 v2(9.14,39.37)
MOTOR_N: length 44.9
  Top Layer w0.813: U6.6 U6.7 2.41,8.76 1.52,7.88 1.52,2.54 3.05,1.02 27.43,1.02 30.48,4.06 U3.1 U3.2
MOTOR_P: length 23.5
  Top Layer w0.813: U6.15 U6.14 34.42,8.76 35.56,7.62 U3.3 U3.4
MOTOR_THERMAL_PAD:
  vias: v2(8.64,15.24) v2(8.64,14.22) v2(8.64,13.21) v2(8.64,12.19) v2(8.64,11.18) v2(8.64,10.16) v2(8.64,9.14) v2(8.64,8.13) v2(8.64,7.11) v2(8.64,6.1) v2(9.65,14.73) v2(9.65,13.72) v2(9.65,12.7) v2(9.65,11.68) v2(9.65,10.67) v2(9.65,9.65) v2(9.65,8.64) v2(9.65,7.62) v2(9.65,6.6) v2(10.67,15.24) v2(10.67,14.22) v2(10.67,13.21) v2(10.67,12.19) v2(10.67,11.18) v2(10.67,10.16) v2(10.67,9.14) v2(10.67,8.13) v2(10.67,7.11) v2(10.67,6.1) v2(11.68,14.73) v2(11.68,13.72) v2(11.68,12.7) v2(11.68,11.68) v2(11.68,10.67) v2(11.68,9.65) v2(11.68,8.64) v2(11.68,7.62) v2(11.68,6.6) v2(12.7,15.24) v2(12.7,14.22) v2(12.7,13.21) v2(12.7,12.19) v2(12.7,11.18) v2(12.7,10.16) v2(12.7,9.14) v2(12.7,8.13) v2(12.7,7.11) v2(12.7,6.1)
RESET#: length 48
  Top Layer w0.254: U6.20 17.57,20.62 v2(18.54,21.59) ; U1.28 35.81,33.27 37.08,34.54 43.69,34.54 45.72,32.51 45.72,27.94 44.44,26.66 U7.19
  Bottom Layer w0.254: U1.28 35.81,31.24 34.04,29.46 26.42,29.46 v2(18.54,21.59)
TPS1: length 46.9
  Top Layer w0.254: U1.19 12.95,29.72 15.75,26.92 18.8,26.92 21.34,24.38 21.34,12.19 23.88,9.65 38.61,9.65 40.64,7.62 U3.5
TPS2: length 46.9
  Top Layer w0.254: U3.6 43.18,7.62 40.74,10.06 24.04,10.06 21.74,12.36 21.74,24.55 18.96,27.33 17.88,27.33 15.49,29.72 U1.20
WSPEED_IO: length 23.1
  Top Layer w0.254: 30.73,46.61 30.73,44.96 31.5,44.2 44.2,44.2 45.97,45.97 R5.1 48.52,45.97 49.28,45.21 U5.3
WSPEED_SENSOR: length 30.5
  Top Layer w0.254: U2.6 40.64,17.78 42.37,19.51 44.53,19.51 46.97,21.95 50.97,21.95 52.83,23.81 R1.2 R2.2
$3N506: length 27.7
  Top Layer w0.254: U8.1 51.69,23.24 50.8,22.35 46.8,22.35 44.36,19.91 40.98,19.91 39.73,21.17 39.73,27.26 38.95,28.04 36.24,28.04 35.97,27.77 35.97,27.43 36.09,27.31 U7.1
$3N511: length 24.9
  Top Layer w0.254: U8.4 47.88,24 44.2,20.32 41.15,20.32 40.13,21.34 40.13,27.43 39.12,28.45 36.07,28.45 35.56,27.94 35.56,26.92 35.82,26.66 U7.2
$3N1213: length 9.9
  Top Layer w0.254: U7.8 33.56,22.76 ; 33.56,22.76 30.33,22.76 29.63,23.46 U10.3 ; 33.56,22.76 33.53,22.79 C2.1
$3N1221: length 6.5
  Top Layer w0.254: U7.9 36.21,22.11 35.38,21.27 C3.1 31.82,21.27 U10.1
$4N837: length 5.3
  Top Layer w0.254: U4.1 52.83,36.12 52.83,35.56 52.32,35.05 49.78,35.05 49.28,34.54 R2.1
$4N858: length 8.1
  Top Layer w0.254: R4.1 R3.2 49.28,37.59 49.78,37.08 U4.3
$4N875: length 2.4
  Top Layer w0.254: U5.1 52.83,44.25 R4.2
$5N1075: length 18.3
  Top Layer w0.254: R7.2 11.18,20.83 12.7,19.3 14.22,19.3 14.94,18.59 14.94,13.45 15.75,12.63 15.75,8.13 16.38,7.49 17.57,7.49
$5N1397: length 10
  Top Layer w0.254: C1.2 14.92,19.62 15.34,19.2 15.34,13.61 16.38,12.57 17.57,12.57

## Copper pours and planes (outline as drawn; the poured copper is in the pictures)
+5V on Bottom Layer: 0,48 55,48 55,0 0,0
GND on Top Layer: 0,48 55,48 55,0 0,0
MOTOR_THERMAL_PAD on Top Layer: 5.17,18.67 16.17,18.67 16.17,2.67 5.17,2.67
MOTOR_THERMAL_PAD on Bottom Layer: 5.17,18.67 16.17,18.67 16.17,2.67 5.17,2.67

## Text on the board
Top Silkscreen Layer: MOTOR- | MOTOR+ | THROTTLE MOTOR DRIVER | BRAKE SW | CAN XCVR | TERM | WHEEL SPEED | BRAKE | CLUTCH | CTRLS | WSPEED | TPS1 | CANL | TPS2 | CANH | APP1 | 5vOUT | APP2 | +12V | GND
